# EAGLE design PowerMeter_EADOG (EAGLE 6.1)
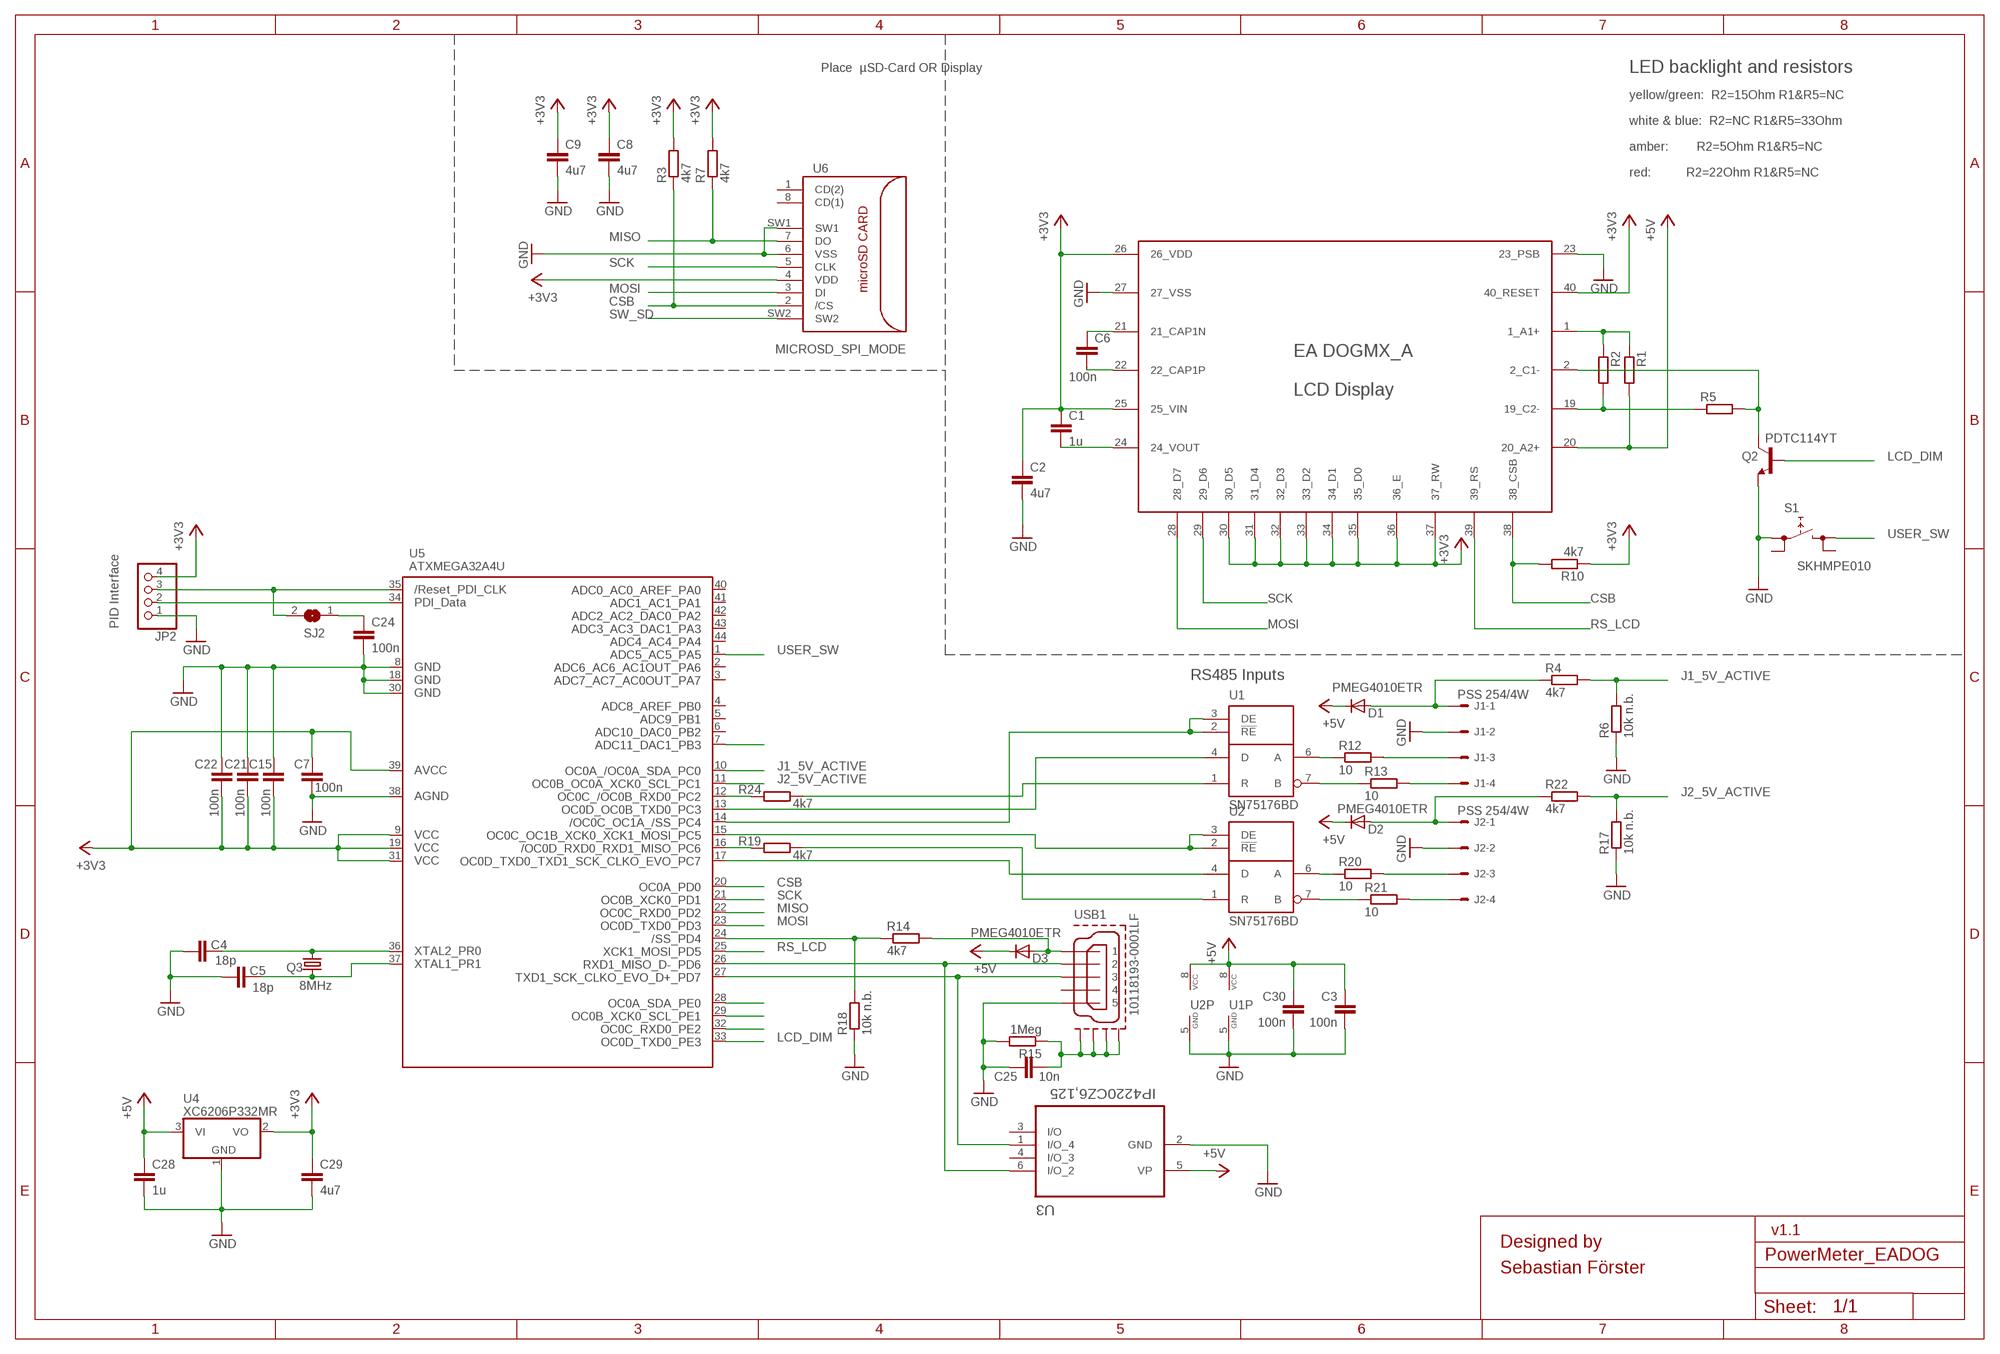
[diagram p0: schematic, sheet 1]

## Parts
C1  1u  C-EUC0603  [C0603]
C2  4u7  C-EUC0603  [C0603]
C3  100n  C-EUC0603  [C0603]
C4  18p  C-EUC0603  [C0603]
C5  18p  C-EUC0603  [C0603]
C6  100n  C-EUC0603  [C0603]
C7  100n  C-EUC0603  [C0603]
C8  4u7  C-EUC0603  [C0603]
C9  4u7  C-EUC0603  [C0603]
C15  100n  C-EUC0603  [C0603]
C21  100n  C-EUC0603  [C0603]
C22  100n  C-EUC0603  [C0603]
C24  100n  C-EUC0603  [C0603]
C25  10n  C-EUC0603  [C0603]
C28  1u  C-EUC0603  [C0603]
C29  4u7  C-EUC0603  [C0603]
C30  100n  C-EUC0603  [C0603]
D1  PMEG4010ETR  MBR0520LT  [SOD123]
D2  PMEG4010ETR  MBR0520LT  [SOD123]
D3  PMEG4010ETR  MBR0520LT  [SOD123]
J1  PSS 254/4W  22-27-2041-04  [6410-04]
J2  PSS 254/4W  22-27-2041-04  [6410-04]
JP2  PINHD-1X4_2.00  [1X04M]
LCD1  DOGM162X-AX  [EA_DOGM]
Q2  PDTC114YT  BC848ALT1SMD  [SOT23]
Q3  8MHz  CRYSTALHC49UP  [HC49UP]
R1  R-EU_R0603  [R0603]
R2  R-EU_R0603  [R0603]
R3  4k7  R-EU_R0603  [R0603]
R4  4k7  R-EU_R0603  [R0603]
R5  R-EU_R0603  [R0603]
R6  10k n.b.  R-EU_R0603  [R0603]
R7  4k7  R-EU_R0603  [R0603]
R10  4k7  R-EU_R0603  [R0603]
R12  10  R-EU_R0603  [R0603]
R13  10  R-EU_R0603  [R0603]
R14  4k7  R-EU_R0603  [R0603]
R15  1Meg  R-EU_R0603  [R0603]
R17  10k n.b.  R-EU_R0603  [R0603]
R18  10k n.b.  R-EU_R0603  [R0603]
R19  4k7  R-EU_R0603  [R0603]
R20  10  R-EU_R0603  [R0603]
R21  10  R-EU_R0603  [R0603]
R22  4k7  R-EU_R0603  [R0603]
R24  4k7  R-EU_R0603  [R0603]
S1  SKHMPE010  [SKHMPXE010]
SJ2  SJ  [SJ]
U1  SN75176BD  75ALS176AD  [SO-08]
U2  SN75176BD  75ALS176AD  [SO-08]
U3  IP4220CZ6,125  IP4220CZ6  [SOT95P275X110-6N]
U4  XC6206P332MR  [SOT23]
U5  ATXMEGA32A4U  AVR_XMEGA_A4U_  [TQFP44]
U6  MICROSD_SPI_MODE  [MICRO_SD_CONNECTOR]
USB1  10118193-0001LF  MOLEX-47346-0001  [MOLEX-47364-0001]

## Nets
+3V3: C1.1 C2.1 C7.1 C8.1 C9.1 C15.2 C21.2 C22.2 C29.1 JP2.4 LCD1.25(25_VIN) LCD1.26(26_VDD) LCD1.30(30_D5) LCD1.31(31_D4) LCD1.32(32_D3) LCD1.33(33_D2) LCD1.34(34_D1) LCD1.35(35_D0) LCD1.36(36_E) LCD1.37(37_RW) LCD1.40(40_RESET) R3.2 R7.2 R10.1 U4.2(VO) U5.9(VCC1) U5.19(VCC2) U5.31(VCC3) U5.39(AVCC) U6.4(VDD)
+5V: C3.1 C28.1 C30.1 D1.C D2.C D3.C LCD1.20(20_A2+) R1.2 U1.8(VCC) U2.8(VCC) U3.5(VP) U4.3(VI)
CSB: LCD1.38(38_CSB) R3.1 R10.2 U5.20(PD0) U6.2(/CS)
GND: C2.2 C3.2 C4.1 C5.1 C7.2 C8.2 C9.2 C15.1 C21.1 C22.1 C24.2 C25.1 C28.2 C29.2 C30.2 J1.2 J2.2 JP2.1 LCD1.23(23_PSB) LCD1.27(27_VSS) Q2.2(E) R6.1 R15.2 R17.1 R18.1 S1.1(1.1) U1.5(GND) U2.5(GND) U3.2(GND) U4.1(GND) U5.8(GND1) U5.18(GND2) U5.30(GND3) U5.38(AGND) U6.6(VSS) U6.SW1 USB1.5
J1_5V_ACTIVE: R4.2 R6.2 U5.10(PC0)
J2_5V_ACTIVE: R17.2 R22.2 U5.11(PC1)
LCD_DIM: Q2.1(B) U5.33(PE3)
MISO: R7.1 U5.22(PD2) U6.7(DO)
MMM: D2.A J2.1 R22.1
MOSI: LCD1.28(28_D7) U5.23(PD3) U6.3(DI)
N$1: R21.1 U2.7(B)
N$2: R20.1 U2.6(A)
N$3: R19.2 U2.1(R)
N$4: LCD1.2(2_C1-) Q2.3(C) R5.2
N$5: U2.2(!RE) U2.3(DE) U5.15(PC5)
N$6: U2.4(D) U5.17(PC7)
N$7: J2.3 R20.2
N$8: J2.4 R21.2
N$9: LCD1.19(19_C2-) R2.2 R5.1
N$10: LCD1.1(1_A1+) R1.1 R2.1
N$12: R19.1 U5.16(PC6)
N$13: U5.29(PE1)
N$15: U1.2(!RE) U1.3(DE) U5.14(PC4)
N$16: U5.7(PB3)
N$20: JP2.3 SJ2.2 U5.35(RESET)
N$21: C4.2 Q3.1 U5.36(PR0)
N$22: JP2.2 U5.34(PDI_DATA)
N$23: R14.1 R18.2 U5.24(PD4)
N$24: C5.2 Q3.2 U5.37(PR1)
N$26: R13.1 U1.7(B)
N$27: R12.1 U1.6(A)
N$28: C25.2 R15.1 USB1.GND1 USB1.GND2 USB1.GND3 USB1.GND4
N$30: U3.6(I/O_2) U5.26(PD6) USB1.2
N$31: U3.1(I/O_4) U5.27(PD7) USB1.3
N$32: U5.32(PE2)
N$33: C1.2 LCD1.24(24_VOUT)
N$34: C6.2 LCD1.22(22_CAP1P)
N$35: C6.1 LCD1.21(21_CAP1N)
N$37: C24.1 SJ2.1
N$39: D3.A R14.2 USB1.1
N$41: R24.2 U1.1(R)
N$44: U1.4(D) U5.13(PC3)
N$45: J1.3 R12.2
N$46: J1.4 R13.2
N$47: R24.1 U5.12(PC2)
NNN: D1.A J1.1 R4.1
RS_LCD: LCD1.39(39_RS) U5.25(PD5)
SCK: LCD1.29(29_D6) U5.21(PD1) U6.5(CLK)
SW_SD: U5.28(PE0) U6.SW2
USER_SW: S1.3(2.3) U5.1(PA5)
Unconnected: S1.2(1.2) S1.4(2.4) U3.3(I/O) U3.4(I/O_3) U5.2(PA6) U5.3(PA7) U5.4(PB0) U5.5(PB1) U5.6(PB2) U5.40(PA0) U5.41(PA1) U5.42(PA2) U5.43(PA3) U5.44(PA4) U6.1(CD(2)) U6.8(CD(1)) USB1.4

## Notes on the sheet
- Place  µSD-Card OR Display | LED backlight and resistors
- yellow/green:  R2=15Ohm R1&R5=NC
- white & blue:  R2=NC R1&R5=33Ohm
- amber:        R2=5Ohm R1&R5=NC
- red:          R2=22Ohm R1&R5=NC
- PID Interface
- RS485 Inputs
- v1.1
- Designed by
- Sebastian Förster

## Library data of the parts
C1-C9 C15 C21 C22 C24 C25 C28-C30 = rcl:C-EU: CAPACITOR, European symbol
D1-D3 = diode:MBR0520LT: SCHOTTKY BARRIER RECTIFIER Source: http://onsemi.com .. MBR0520LT1-D.pdf
J1 J2 = con-molex:22-?-04: CONNECTOR wire to board 2.54 mm (.1 inch) pitch header; OC_FARNELL: unknown; OC_NEWARK: unknown
JP2 = pinhead:PINHD-1X4: PIN HEADER
LCD1 = ea:DOGM162X-A: DOG-SERIE 3,3V SUPER FLACH / 55x27mm INKL. KONTROLLER ST7036 FÜR 4-/8-BIT, SPI (4-DRAHT) TECHNISCHE DATEN * KONTRASTREICHE LCD-SUPERTWIST ANZEIGE * OPTIONALE LED-BELEUCHTUNGSKÖRPER IN VERSCHIEDENEN FARBEN * 1x8, 2x16 UND 3x16 ZEICHEN MIT 12,0 mm / 5,6 mm UND 3,6 mm SCHRIFT * KONTROLLER ST 7036 FÜR 4-BIT, 8-BIT UND SPI (4-DRAHT) INTERFACE * SPANNUNGSVERSORGUNG +3,3V ODER +5V SINGLE SUPPLY (typ. 250?A) * KEINE ZUS. SPANNUNGEN ERFORDERLICH * BETRIEBSTEMPERATURBEREICH -20..+70°C * LED-HINTERGRUNDBELEUCHTUNG 3..80mA@3,3V oder 2..40mA@5V * KEINE MONTAGE ERFORDERLICH: EINFACH NUR IN PCB EINLÖTEN BESTELLBEZEICHNUNG LCD-MODUL 1x8 - 11,97mm EA DOGM081x-A LCD-MODUL 2x16 - 5,57mm EA DOGM162x-A LCD-MODUL 3x16 - 3,65mm EA DOGM163x-A x: B = blauer Hintergrund E = Gelb/grüner Hintergrund L = Gelb/grüner Hintergrund (nicht beleuchtbar) S = schwarzer Hintergrund W = weisser Hintergrund LED-BELEUCHTUNG WEISS EA LED55X31-W LED-BELEUCHTUNG GELB/GRÜN EA LED55X31-G LED-BELEUCHTUNG BLAU EA LED55X31-B LED-BELEUCHTUNG ROT EA LED55X31-R LED-BELEUCHTUNG AMBER EA LED55X31-A BUCHSENLEISTE 4,8mm HOCH (2 STÜCK ERFORDERLICH) EA FL-20P
Q2 = transistor-npn:BC848*: NPN Transistor
Q3 = crystal:CRYSTAL: CRYSTAL
R1-R7 R10 R12-R15 R17-R22 R24 = rcl:R-EU_: RESISTOR, European symbol
S1 = ReicheltSMDTaster:SKHMP*E010: Ausführung 6,0 x 6,0 mm mit SMD-Anschlüssen Serie LSH Typ 1301.. (G070.710)
SJ2 = jumper:SJ: SMD solder JUMPER
U1 U2 = texas:75ALS176: DIFFERENTIAL BUS TRANSCEIVERS TIA/EIA-422-B, TIA/EIA-422-B + TIA/EIA-422-B TIA/EIA-422-B Operate at Data Rates up to 35 Mbaud Source: http://focus.ti.com/lit/ds/symlink/sn65als176.pdf; MF: TEXAS INSTRUMENTS; MPN: SN75ALS176AD; OC_FARNELL: 1410742; OC_NEWARK: 76C5099
U3 = USB_ESD_NXP_IP4220CZ6:IP4220CZ6: Dual Schmitt-Trigger Inverter; MPN: IP4220CZ6; OC_FARNELL: 1506629; OC_NEWARK: 61M6815; PACKAGE: SSOT-6; SUPPLIER: NXP
U4 = LDO_AAT3220:XC6206P332MR
U5 = xmega:AVR_XMEGA_A4U_
U6 = con-molex-microsd:MICROSD_SPI_MODE: MOLEX - 49225-0821 - CONNECTEUR MICRO SD PUSH/PUSH REV Fabricant: MOLEX Code commande Farnell: 1366700 <http://fr.farnell.com/molex/49225-0821/connecteur-micro-sd-push-push-rev/dp/1366700?Ntt=1366700> Référence fabricant: 49225-0821
USB1 = usb_con-update:MOLEX-47346-0001: MICRO USB B, BOTTOM MOUNT

## Board
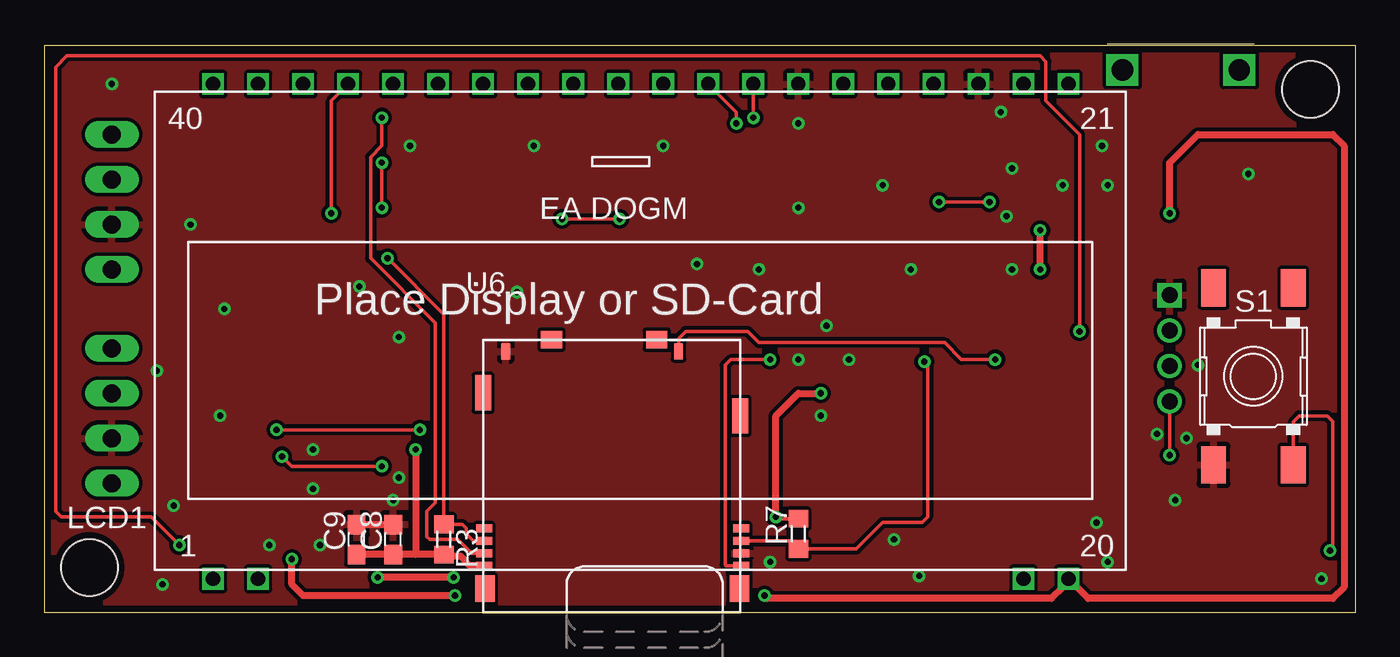
[diagram p1: board, top side]
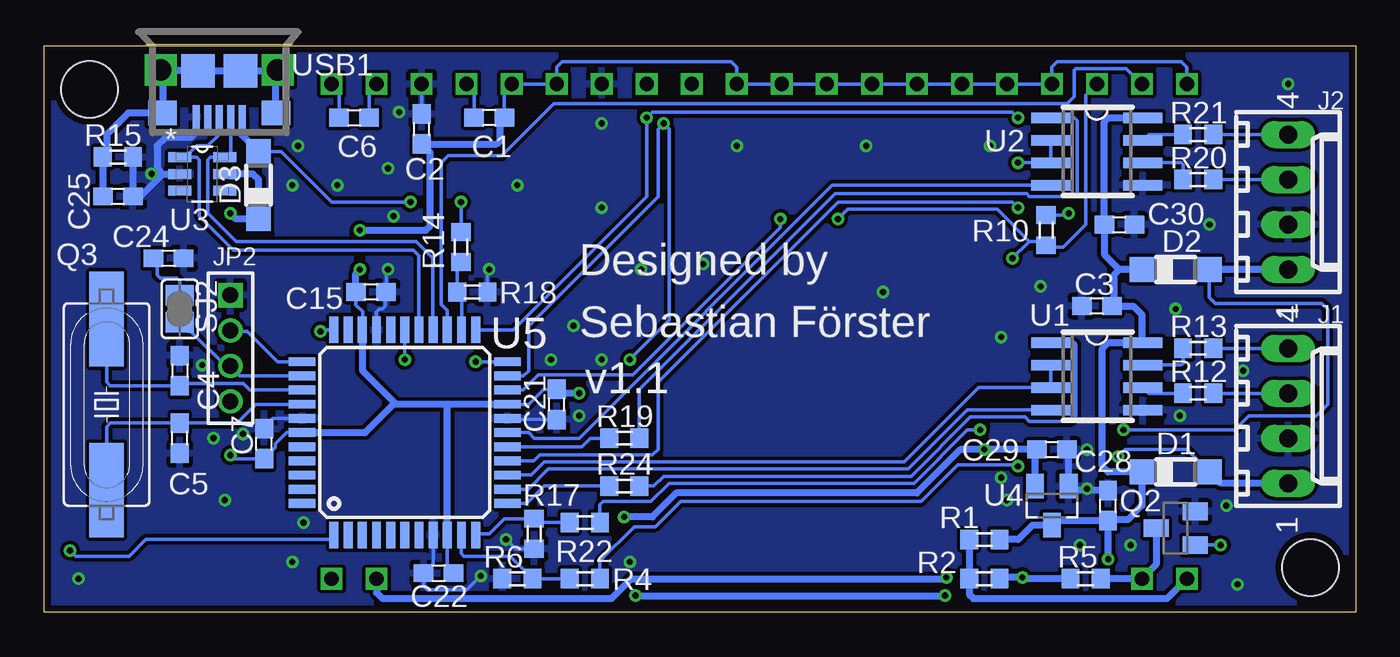
[diagram p2: board, bottom side, seen from below]

Size 74 x 32 mm. Coordinates in mm from the lower left corner, seen from the top.
Outline: 0,0 74,0 74,32 0,32 0,0
Copper layers (1*16): Top 0.0356mm / dielectric 1.5011mm / Bottom 0.0356mm
Design rules: minimum track width 6mil, minimum drill 13mil, track to track 6mil, track to pad 6mil, pad to pad 6mil, via to via 6mil, smd to smd 6mil, copper to edge 15mil, drill to drill 6mil, minimum pad ring 7mil, minimum via ring 7mil, stop-mask expansion 4mil, vias tented up to drill 50mil, thermal gap 10mil
Holes 3.2 mm at 2.54,2.54 71.44,29.53

### Footprints (pad centres in the part's own frame; a part is rotated, then mirrored left to right if it is on the bottom)
C0603 = smd 1.1 x 1: 1 -0.85,0; 2 0.85,0
SOD123 = smd 1.4 x 1.4: A 1.9,0; C -1.9,0
6410-04 = drill 1.016 long: 1 3.81,0; 2 1.27,0; 3 -1.27,0; 4 -3.81,0
1X04M = drill 0.914 square: 1 -3,0 | drill 0.914: 2 -1,0; 3 1,0; 4 3,0
EA_DOGM = drill 0.813 square: 1 0,0; 2 2.54,0; 19 45.72,0; 20 48.26,0; 21 48.26,27.94; 22 45.72,27.94; 23 43.18,27.94; 24 40.64,27.94; 25 38.1,27.94; 26 35.56,27.94; 27 33.02,27.94; 28 30.48,27.94; 29 27.94,27.94; 30 25.4,27.94; 31 22.86,27.94; 32 20.32,27.94; 33 17.78,27.94; 34 15.24,27.94; 35 12.7,27.94; 36 10.16,27.94; 37 7.62,27.94; 38 5.08,27.94; 39 2.54,27.94; 40 0,27.94
SOT23 = smd 1 x 1.4: 1 -0.95,-1.1; 2 0.95,-1.1; 3 0,1.1
HC49UP = smd 5.334 x 1.93: 1 -4.826,0; 2 4.826,0
R0603 = smd 1 x 1.1: 1 -0.85,0; 2 0.85,0
SKHMPXE010 = smd 2.1 x 1.4: 1 -4.2,2.25; 2 5.8,2.25; 3 -4.2,-2.25; 4 5.8,-2.25
SJ = smd 1.168 x 1.6: 1 -0.762,0; 2 0.762,0
SO-08 = smd 0.6 x 2.2: 1 -1.905,-2.6; 2 -0.635,-2.6; 3 0.635,-2.6; 4 1.905,-2.6; 5 1.905,2.6; 6 0.635,2.6; 7 -0.635,2.6; 8 -1.905,2.6
SOT95P275X110-6N = smd 1.321 x 0.559: 1 -1.27,0.94; 2 -1.27,0; 3 -1.27,-0.94; 4 1.27,-0.94; 5 1.27,0; 6 1.27,0.94
TQFP44 = smd 1.5 x 0.5: 1 -5.8,4; 2 -5.8,3.2; 3 -5.8,2.4; 4 -5.8,1.6; 5 -5.8,0.8; 6 -5.8,0; 7 -5.8,-0.8; 8 -5.8,-1.6; 9 -5.8,-2.4; 10 -5.8,-3.2; 11 -5.8,-4; 23 5.8,-4; 24 5.8,-3.2; 25 5.8,-2.4; 26 5.8,-1.6; 27 5.8,-0.8; 28 5.8,0; 29 5.8,0.8; 30 5.8,1.6; 31 5.8,2.4; 32 5.8,3.2; 33 5.8,4 | smd 0.5 x 1.5: 12 -4,-5.8; 13 -3.2,-5.8; 14 -2.4,-5.8; 15 -1.6,-5.8; 16 -0.8,-5.8; 17 0,-5.8; 18 0.8,-5.8; 19 1.6,-5.8; 20 2.4,-5.8; 21 3.2,-5.8; 22 4,-5.8; 34 4,5.8; 35 3.2,5.8; 36 2.4,5.8; 37 1.6,5.8; 38 0.8,5.8; 39 0,5.8; 40 -0.8,5.8; 41 -1.6,5.8; 42 -2.4,5.8; 43 -3.2,5.8; 44 -4,5.8
MICRO_SD_CONNECTOR = smd 0.9 x 0.45: 1 0.05,4.75; 2 0.05,4.05; 3 0.05,3.35; 4 0.05,2.65; 5 14.55,2.65; 6 14.55,3.35; 7 14.55,4.05; 8 14.55,4.75 | smd 1.1 x 1.5: P$1 0.1,1.35; P$2 14.45,1.35 | smd 0.9 x 2: P$3 0,12.4; P$4 14.5,11.1 | smd 1.2 x 1: P$5 3.85,15.4; P$6 9.8,15.4 | smd 0.5 x 0.9: SW1 1.275,14.75; SW2 11.025,14.75
MOLEX-47364-0001 = smd 1.35 x 0.4: 1 2.67,1.3; 2 2.67,0.65; 3 2.67,0; 4 2.67,-0.65; 5 2.67,-1.3 | smd 1.9 x 1.9: GND1 0.05,1.2; GND4 0.05,-1.2 | smd 1.4 x 1.6: GND2 2.43,3.2; GND3 2.43,-3.2 | drill 1.2 square: P$1 0,-3.3; P$2 0,3.3

### Placement (x,y rotation side)
C1  48.9,27.94 180 bottom
C2  52.7,27.3 90 bottom
C3  14.61,17.3 180 bottom
C4  66.36,13.65 270 bottom
C5  66.36,9.84 90 bottom
C6  56.52,27.94 0 bottom
C7  61.59,9.53 90 bottom
C8  19.68,4.13 90 top
C9  17.62,4.13 90 top
C15  55.56,18.1 180 bottom
C21  45.09,11.75 90 bottom
C22  51.75,2.22 0 bottom
C24  66.99,20 0 bottom
C25  69.85,23.5 180 bottom
C28  13.97,6.03 90 bottom
C29  17.14,9.21 0 bottom
C30  13.34,21.91 0 bottom
D1  10.16,7.94 0 bottom
D2  10.16,19.37 0 bottom
D3  61.91,24.13 90 bottom
J1  3.81,11.11 270 bottom
J2  3.81,23.18 270 bottom
JP2  63.5,14.92 270 bottom
LCD1  9.53,1.91 0 top
Q2  10.16,4.76 90 bottom
Q3  70.48,11.75 270 bottom
R1  20.95,4.13 0 bottom
R2  20.95,1.91 0 bottom
R3  22.54,4.13 270 top
R4  43.5,1.91 180 bottom
R5  15.24,1.91 0 bottom
R6  47.31,1.91 0 bottom
R7  42.55,4.45 90 top
R10  17.46,21.59 270 bottom
R12  8.89,12.38 0 bottom
R13  8.89,14.92 0 bottom
R14  50.48,20.64 90 bottom
R15  69.85,25.72 0 bottom
R17  46.35,4.45 90 bottom
R18  49.85,18.1 180 bottom
R19  41.27,9.84 0 bottom
R20  8.89,24.45 0 bottom
R21  8.89,26.99 0 bottom
R22  43.5,5.08 180 bottom
R24  41.27,7.14 0 bottom
S1  68.23,12.54 90 top
SJ2  66.36,17.14 270 bottom
U1  14.61,13.34 270 bottom
U2  14.61,26.04 270 bottom
U3  65.09,24.77 0 bottom
U4  17.14,6.03 180 bottom
U5  53.66,10.16 90 bottom
U6  24.77,0 0 top
USB1  64.14,30.64 270 bottom

### Tracks (layer width: path | path; a pad name or v marks a point on that pad's centre or on a via)
+3V3  (via drill 0.35)
  Top 0.203: v63.5,8.89 JP2.4 | v16.19,22.54 16.19,28.89 LCD1.37 | R7.2 41.38,5.29 v41.27,5.4 | C8.1 19.68,3.17
  Top 0.406: v41.27,5.4 41.27,11.11 42.55,12.38 v43.81,12.38 | v56.2,19.37 v56.2,21.59 | U6.4 24.02,2.65 23.5,3.17 22.64,3.17 R3.2 20.95,3.28 | 20.95,3.28 19.79,3.28 19.68,3.17 | C8.1 C9.1 | v20.95,9.21 20.95,3.28
  Bottom 0.203: U5.9 51.26,2.58 C22.2 | C21.2 45.82,12.6 46.67,11.75 47.84,11.75 U5.19 | C15.2 56.41,17.36 56.04,16.99 56.04,15.98 U5.31 | C1.1 48.05,29.43 LCD1.25 LCD1.26 45.09,30.8 44.77,31.11 35.24,31.11 34.92,30.8 LCD1.30 LCD1.31 LCD1.32 LCD1.33 LCD1.34 LCD1.35 LCD1.36 LCD1.37 17.14,30.8 16.83,31.11 9.84,31.11 9.53,30.8 LCD1.40 | U5.39 60.33,10.16 60.96,9.53 60.96,9.31 C7.1 63.28,8.68 v63.5,8.89 | R10.1 16.3,22.44 v16.19,22.54
  Bottom 0.406: U4.2 18.09,9.11 C29.1 v20.95,9.21 22.3,9.21 24.77,6.75 38.34,6.75 39.69,5.4 v41.27,5.4 | U5.19 51.12,11.76 | 51.12,11.76 54.15,11.76 54.21,11.83 | 54.21,11.83 56.06,13.67 U5.31 | U5.39 55.88,10.16 54.21,11.83 | U5.9 51.26,11.62 51.12,11.76 | C1.1 48.26,27.73 48.26,26.67 48.48,26.45 C2.1 52.23,25.98 52.23,21.83 52.47,21.59 v56.2,21.59 | v43.81,12.38 44.77,12.38 45.09,12.7 C21.2 | C15.2 56.41,19.15 v56.2,19.37
+5V  (via drill 0.35)
  Top 0.406: v63.5,22.54 63.5,25.4 65.09,26.99 72.71,26.99 73.34,26.35 73.34,1.43 72.71,0.79 58.9,0.79 LCD1.20 57.47,1.43 56.83,0.79 40.8,0.79 v40.64,0.95 | v23.18,0.95 14.61,0.95 13.97,1.59 v13.97,3.02
  Bottom 0.406: U3.5 62.23,24.77 61.91,24.45 D3.C 63.19,22.23 v63.5,22.54 | v13.97,3.02 C28.1 | C28.1 16.89,5.18 U4.3 18.25,4.93 19.05,4.13 R1.2 | C28.1 13.91,5.24 12.86,5.24 12.06,6.04 D1.C 13.97,7.94 14.29,8.26 14.29,14.92 13.97,15.24 U1.8 12.06,15.3 12.06,16.83 12.54,17.3 C3.1 13.65,17.41 13.65,19.05 13.34,19.37 | D2.C 13.34,19.37 | 13.34,19.37 14.19,20.22 C30.1 14.19,27.73 13.97,27.94 U2.8 | v40.64,0.95 v23.18,0.95
CSB  (via drill 0.35)
  Top 0.203: v32.46,22.23 v29.21,22.23 | 22.54,5.08 22.54,16.83 v19.37,20 | U6.2 24.21,4.05 23.81,4.45 23.81,4.76 23.6,4.98 R3.1
  Top 0.406: 22.54,5.08 R3.1
  Bottom 0.203: LCD1.38 15.24,29.21 15.24,21.91 16.51,20.64 17.46,20.64 R10.2 17.68,20.95 18.41,20.95 | U5.20 46.97,12.56 46.12,13.41 40.8,13.41 32.46,21.75 v32.46,22.23 | v29.21,22.23 28.65,22.78 20.24,22.78 18.41,20.95 | v19.37,20 18.41,20.95
GND  (via drill 0.35)
  Top 0.406: C9.2 C8.2
  Bottom 0.203: U5.8 52.06,2.77 C22.1 52.6,1.49 52.39,1.27 50.16,1.27 v49.37,2.06 | C21.1 47.8,10.9 U5.18 | U5.30 55.26,16.97 55.09,17.14 54.93,17.14 54.77,17.3 54.77,18.04 C15.1 54.71,19.27 v54.61,19.37 | C2.2 LCD1.23 | U5.38 61.11,10.96 61.59,10.48 C7.2 | R17.1 47.41,3.6 v47.94,4.13 | R18.1 49,19.27 v48.9,19.37
  Bottom 0.406: USB1.5 65.44,27.12 65.72,26.83 67.15,26.83 67.63,26.35 67.63,25.08 67.31,24.77 | 67.31,24.77 U3.2 | R15.2 C25.1 68.58,23.5 67.31,24.77 | C28.2 15.95,6.88 U4.1 16.2,9.11 C29.2 | 66.25,8.89 C5.1
  other vias: 64.45,9.84 62.79,10.08 43.81,11.11 15.16,9.21 9.92,11.11 44.13,16.19 20.64,26.35 34.92,26.35 17.78,18.41 26.67,18.1 20,7.62 19.68,6.35 40.96,2.86 60.01,2.86 72.07,1.91 59.37,5.08 53.98,28.26 67.94,24.77 8.26,21.91 3.81,29.84 6.67,1.59 60.01,24.13 54.29,22.38 57.47,24.13 42.55,27.62 42.55,22.86 45.4,14.29 42.55,14.29 15.16,6.99 59.69,26.35 54.61,25.08 47.31,24.13 40.32,19.37 36.83,19.68 27.62,26.35 20,15.56 10.16,17.14 7.3,6.03 63.82,6.35 65.09,13.97 15.56,3.81 12.7,3.81 6.35,13.65
  pour Bottom (isolate 0.203): 0,0 74,0 74,32 0,32
  pour Top (isolate 0.203): 0,0 74,0 74,32 0,32
J1_5V_ACTIVE
  Bottom 0.203: R4.2 R6.2 46.46,1.93 47.7,3.17 50.32,3.17 50.48,3.33 50.48,4.33 U5.10
J2_5V_ACTIVE
  Bottom 0.203: R22.2 46.25,5.08 R17.2 48.05,5.29 48.9,4.45 49.57,4.45 U5.11
LCD_DIM  (via drill 0.35)
  Top 0.203: v58.42,15.88 58.42,26.99 56.52,28.89 56.52,31.11 56.2,31.43 1.27,31.43 0.64,30.8 0.64,5.71 0.95,5.4 6.03,5.4 v7.62,3.81
  Bottom 0.203: U5.33 58.34,15.96 v58.42,15.88 | v7.62,3.81 9.21,3.81 Q2.1
MISO  (via drill 0.35)
  Top 0.203: U6.7 42.09,4.05 R7.1 45.82,3.6 47.31,5.08 49.53,5.08 49.85,5.4 49.85,13.97 v49.66,14.16
  Bottom 0.203: U5.22 v49.66,14.16
MMM  (via drill 0.35)
  Top 0.203: v21.19,10.32 v13.1,10.32
  Bottom 0.203: R22.1 42.65,6.09 42.47,6.27 39.77,6.27 38.73,7.3 24.92,7.3 21.91,10.32 v21.19,10.32 | v13.1,10.32 6.83,10.32 6.03,11.11 2.22,11.11 1.59,11.75 1.59,17.14 1.91,17.46 7.94,17.46 8.26,17.78 D2.A
  Bottom 0.406: J2.1 D2.A
MOSI  (via drill 0.35)
  Top 0.203: v40.01,27.94 LCD1.28 | v19.05,27.94 19.05,26.35 18.41,25.72 18.41,20 22.07,16.35 22.07,6.19 21.59,5.71 21.59,4.29 21.75,4.13 23.34,4.13 24.11,3.35 U6.3
  Bottom 0.203: U5.23 47.54,15.96 40.01,23.5 v40.01,27.94 39.69,28.26 19.37,28.26 v19.05,27.94
N$1
  Bottom 0.203: R21.1 11.69,26.99 U2.7
N$2
  Bottom 0.203: R20.1 9.74,25.3 9.84,25.4 U2.6
N$3
  Bottom 0.203: R19.2 40.42,12.6 29.37,23.65 18.57,23.65 18.41,23.5 15.95,23.5 15.72,23.73 15.72,27.78 15.88,27.94 U2.1
N$4
  Bottom 0.406: Q2.3 11.26,2.71 LCD1.2 R5.2
N$5  (via drill 0.35)
  Top 0.203: v19.05,22.86 v19.05,25.4
  Bottom 0.203: U2.2 U2.3 | U5.15 46.37,8.56 46.04,8.89 39.69,8.89 39.37,9.21 39.37,13.02 29.21,23.18 19.37,23.18 v19.05,22.86 | v19.05,25.4 U2.3 | U2.3 17.14,25.4
N$6
  Bottom 0.203: U5.17 46.67,10.16 46.35,9.84 43.81,9.84 29.53,24.13 U2.4 17.14,24.13
N$7
  Bottom 0.203: J2.3 R20.2
N$8
  Bottom 0.203: J2.4 R21.2
N$9  (via drill 0.35)
  Top 0.406: v23.1,1.98 v18.81,1.98
  Bottom 0.406: LCD1.19 55.24,1.11 54.93,0.79 41.99,0.79 40.88,1.91 23.18,1.91 v23.1,1.98 | R5.1 18.73,1.91 v18.81,1.98 20.03,1.98 R2.2
N$10
  Bottom 0.406: R1.1 R2.1 21.8,1.01 21.59,0.79 10.64,0.79 LCD1.1
N$12
  Bottom 0.203: U5.16 43.66,9.36 43.18,9.84 R19.1
N$15
  Bottom 0.203: U1.2 U1.3 21.27,12.7 25.48,8.49 45.8,8.49 46.53,7.76 U5.14
N$20
  Bottom 0.203: U5.35 62.97,13.36 JP2.3 63.77,13.93 65.72,15.88 65.85,15.88 SJ2.2
N$21
  Bottom 0.203: U5.36 62.41,12.56 62.79,12.94 66.22,12.94 C4.2 70.27,12.8 70.48,13.02 Q3.1
N$22
  Bottom 0.203: U5.34 60.83,14.16 62.55,15.88 63.48,15.88 JP2.2
N$23
  Bottom 0.203: U5.24 50.46,17.86 R18.2 50.7,19.68 R14.1
N$24
  Bottom 0.203: U5.37 59.47,11.75 62.07,11.75 63.13,10.69 C5.2 70.27,10.69 70.48,10.48 Q3.2
N$26
  Bottom 0.203: R13.1 9.74,14.07 9.84,13.97 U1.7
N$27
  Bottom 0.203: R12.1 11.69,12.38 U1.6
N$28
  Bottom 0.203: C25.2 70.8,23.5
  Bottom 0.406: USB1.GND2 60.96,28.23 60.96,30.48 61.07,30.59 USB1.GND1 USB1.GND4 67.2,30.59 67.31,30.48 67.31,28.23 USB1.GND3 69.26,28.21 70.48,26.99 70.48,25.93 R15.1 70.7,23.6 70.8,23.5
N$30
  Bottom 0.203: USB1.2 63.48,26.04 U3.6 64.62,25.7 64.77,25.56 64.77,22.54 63.18,20.95 53.02,20.95 52.07,20 52.07,15.88 52.06,15.89 U5.26
N$31
  Bottom 0.203: USB1.3 64.14,26.99 64.77,26.35 65.41,26.35 65.88,25.88 66.19,25.88 U3.1 65.39,25.7 65.25,25.56 65.25,22.38 63.34,20.48 53.18,20.48 52.86,20.16 U5.27
N$33
  Bottom 0.203: C1.2 49.74,29.43 LCD1.24
N$34
  Bottom 0.203: C6.2 55.66,29.43 LCD1.22
N$35
  Bottom 0.203: C6.1 57.37,29.43 LCD1.21
N$37
  Bottom 0.203: SJ2.1 66.36,18.73 66.52,18.89 67.47,18.89 67.63,19.05 67.63,19.79 C24.1
N$39  (via drill 0.35)
  Top 0.203: v50.48,23.18 v53.34,23.18
  Bottom 0.203: R14.2 v50.48,23.18 | v53.34,23.18 57.78,23.18 60.64,26.04 D3.A
  Bottom 0.406: USB1.1 62.84,26.95 D3.A
N$41
  Bottom 0.203: R24.2 39.61,7.14 39.05,7.7 25.08,7.7 21.75,11.03 18.65,11.03 18.41,10.79 16.03,10.79 15.8,11.03 15.8,15.16 15.88,15.24 U1.1
N$44
  Bottom 0.203: U5.13 46.7,6.96 45.56,8.1 25.24,8.1 21.91,11.43 U1.4 17.14,11.43
N$45
  Bottom 0.203: J1.3 7.94,12.38 R12.2 8.26,12.38
N$46
  Bottom 0.203: J1.4 R13.2
N$47
  Bottom 0.203: U5.12 46.78,6.16 45.8,7.14 R24.1
NNN  (via drill 0.35)
  Top 0.203: v19.05,8.26 13.97,8.26 v13.41,8.81
  Bottom 0.203: R4.1 42.65,2.91 40.72,4.84 39.53,4.84 38.1,6.27 24.53,6.27 22.46,8.33 19.13,8.33 v19.05,8.26 | v13.41,8.81 13.02,9.21 9.53,9.21 D1.A
  Bottom 0.406: J1.1 7.62,7.3 D1.A
RS_LCD
  Bottom 0.203: U5.25 51.26,17.05 51.59,17.38 51.59,25.4 51.2,25.8 48.18,25.8 45.24,28.73 16.27,28.73 15.88,29.13 15.88,30.64 15.8,30.72 12.94,30.72 LCD1.39
SCK  (via drill 0.35)
  Top 0.203: v39.05,27.62 39.05,28.26 LCD1.29 | v40.96,14.29 38.73,14.29 38.42,13.97 38.42,2.7 38.47,2.65 U6.5
  Bottom 0.203: U5.21 46.97,13.36 46.67,13.65 46.67,16.19 39.37,23.5 39.37,27.3 v39.05,27.62 38.73,27.3 38.73,16.51 v40.96,14.29
SW_SD  (via drill 0.35)
  Top 0.203: v53.66,14.29 51.75,14.29 50.8,15.24 40.32,15.24 39.69,15.88 36.2,15.88 35.79,15.47 U6.SW2
  Bottom 0.203: U5.28 v53.66,14.29
USER_SW  (via drill 0.35)
  Top 0.203: v72.55,3.49 72.71,3.65 72.71,10.79 72.39,11.11 70.8,11.11 70.48,10.75 S1.3
  Bottom 0.203: U5.1 57.89,4.13 68.26,4.13 69.22,3.17 72.23,3.17 v72.55,3.49

### Text on the board
tPlace: Place Display or SD-Card
bPlace: Designed by | Sebastian Förster | v1.1